# EasyEDA Pro project Soruce.epro, board PCB1
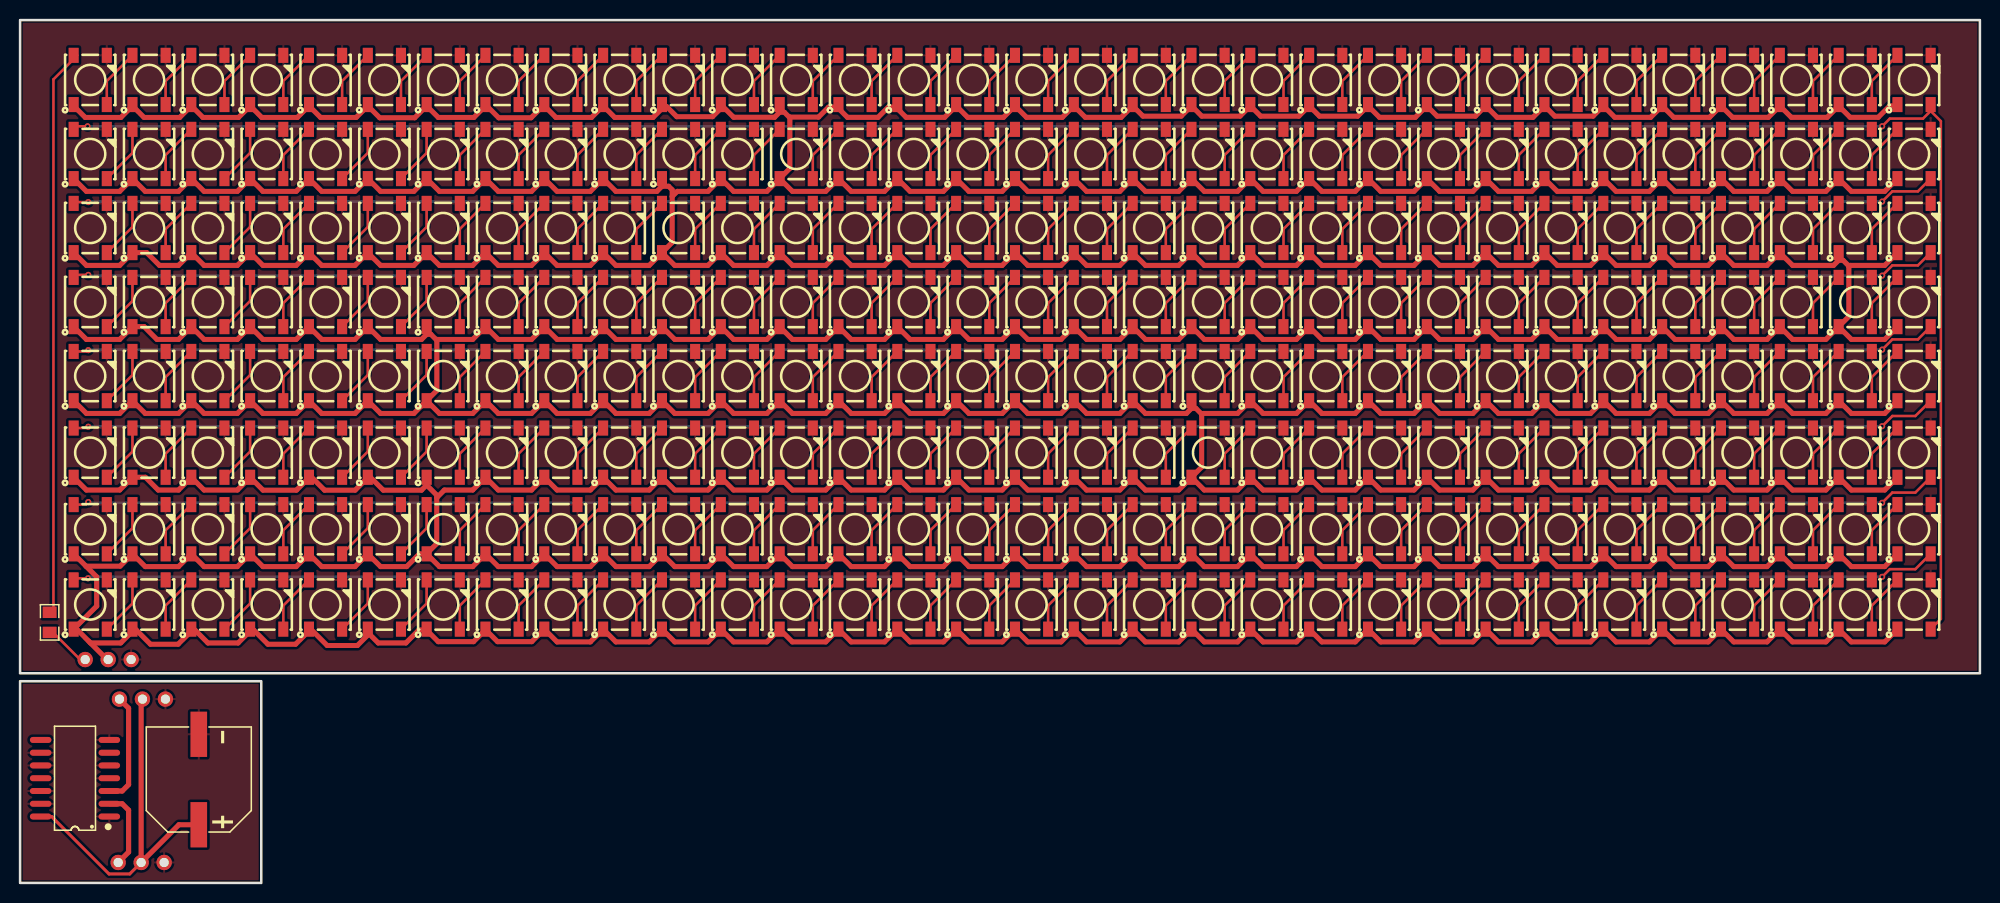
[diagram p3: board, top side]
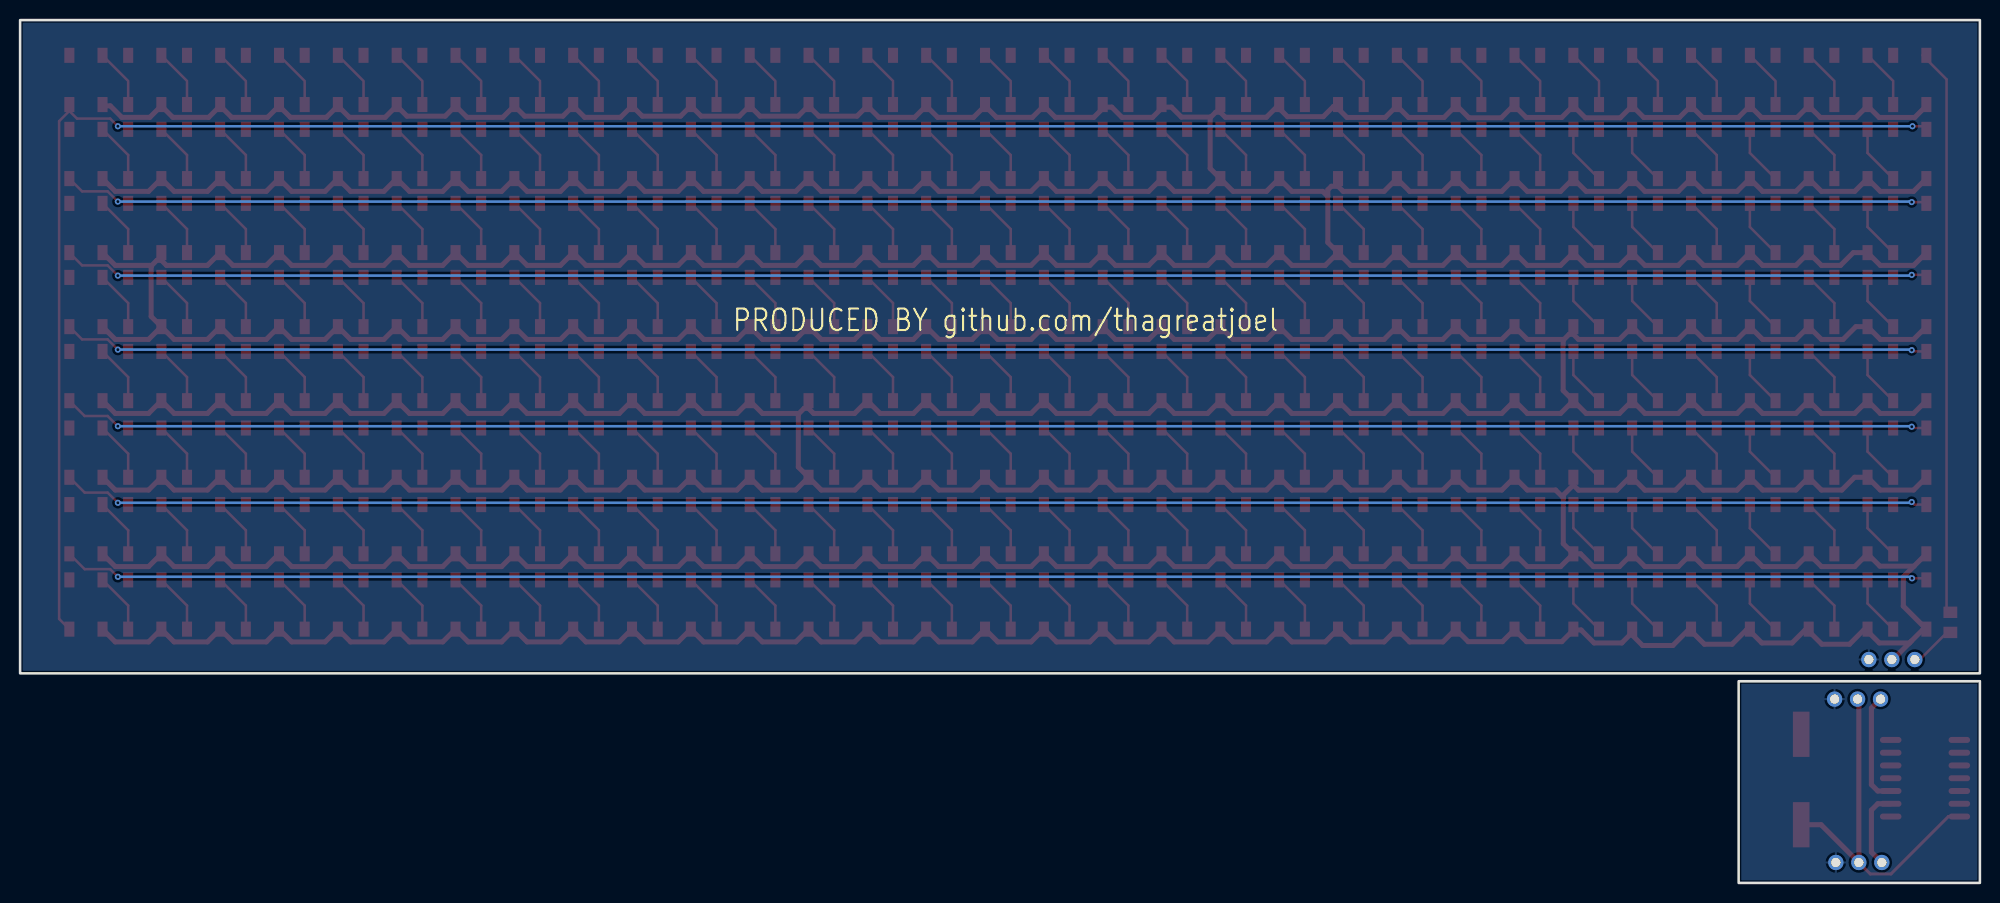
[diagram p4: board, bottom side, seen from below]

Outline 195 x 85.85 mm; copper layers: Top Layer, Bottom Layer. Coordinates in mm from the lower left corner of the outline.
Outline path: rectangle 0,85.85 195,20.85 ; rectangle 0,20.07 24,0
Stack: Top Layer 0.035mm / Dielectric1 1.51mm FR4 er 4.5 / Bottom Layer 0.035mm

## Design rules (mm)
template: JLCPCB Capability(Two Layers Board)
spacing copperThickness1oz (default): track to track 0.102, other pairs 0.152 to 0.3
spacing copperThickness2oz: track to track 0.203, other pairs 0.152 to 0.3
track width copperThickness1oz (default): min 0.127, default 0.254, max 2.54
track width copperThickness2oz: min 0.203, default 0.254, max 2.54
differential pair differentialPair (default): width min 0.127, default 0.254, max 2.54; gap min 0.152, default 0.152
via viaSize (default): diameter min 0.5, default 0.61, max 10; hole min 0.3, default 0.305, max 6.3

## Placement (name value [footprint] x y rotation side)
C1  1000uF  [CAP-SMD_BD10.0-L10.3-W10.3-LS11.3-FD]  17.78 10.29 90 top
LED0  WS2812B-B/T  [LED-SMD_4P-L5.0-W5.0-TL_WS2812B-B]  6.98 79.9 90 top
LED1  WS2812B-B/T  [LED-SMD_4P-L5.0-W5.0-TL_WS2812B-B]  12.83 79.9 90 top
LED2  WS2812B-B/T  [LED-SMD_4P-L5.0-W5.0-TL_WS2812B-B]  18.68 79.9 90 top
LED3  WS2812B-B/T  [LED-SMD_4P-L5.0-W5.0-TL_WS2812B-B]  24.54 79.9 90 top
LED4  WS2812B-B/T  [LED-SMD_4P-L5.0-W5.0-TL_WS2812B-B]  30.39 79.9 90 top
LED5  WS2812B-B/T  [LED-SMD_4P-L5.0-W5.0-TL_WS2812B-B]  36.25 79.9 90 top
LED6  WS2812B-B/T  [LED-SMD_4P-L5.0-W5.0-TL_WS2812B-B]  42.1 79.9 90 top
LED7  WS2812B-B/T  [LED-SMD_4P-L5.0-W5.0-TL_WS2812B-B]  47.95 79.9 90 top
LED8  WS2812B-B/T  [LED-SMD_4P-L5.0-W5.0-TL_WS2812B-B]  53.81 79.9 90 top
LED9  WS2812B-B/T  [LED-SMD_4P-L5.0-W5.0-TL_WS2812B-B]  59.66 79.9 90 top
LED10  WS2812B-B/T  [LED-SMD_4P-L5.0-W5.0-TL_WS2812B-B]  65.52 79.9 90 top
LED11  WS2812B-B/T  [LED-SMD_4P-L5.0-W5.0-TL_WS2812B-B]  71.37 79.9 90 top
LED12  WS2812B-B/T  [LED-SMD_4P-L5.0-W5.0-TL_WS2812B-B]  77.22 79.9 90 top
LED13  WS2812B-B/T  [LED-SMD_4P-L5.0-W5.0-TL_WS2812B-B]  83.08 79.9 90 top
LED14  WS2812B-B/T  [LED-SMD_4P-L5.0-W5.0-TL_WS2812B-B]  88.93 79.9 90 top
LED15  WS2812B-B/T  [LED-SMD_4P-L5.0-W5.0-TL_WS2812B-B]  94.79 79.9 90 top
LED16  WS2812B-B/T  [LED-SMD_4P-L5.0-W5.0-TL_WS2812B-B]  100.64 79.9 90 top
LED17  WS2812B-B/T  [LED-SMD_4P-L5.0-W5.0-TL_WS2812B-B]  106.49 79.9 90 top
LED18  WS2812B-B/T  [LED-SMD_4P-L5.0-W5.0-TL_WS2812B-B]  112.35 79.9 90 top
LED19  WS2812B-B/T  [LED-SMD_4P-L5.0-W5.0-TL_WS2812B-B]  118.2 79.9 90 top
LED20  WS2812B-B/T  [LED-SMD_4P-L5.0-W5.0-TL_WS2812B-B]  124.06 79.9 90 top
LED21  WS2812B-B/T  [LED-SMD_4P-L5.0-W5.0-TL_WS2812B-B]  129.91 79.9 90 top
LED22  WS2812B-B/T  [LED-SMD_4P-L5.0-W5.0-TL_WS2812B-B]  135.76 79.9 90 top
LED23  WS2812B-B/T  [LED-SMD_4P-L5.0-W5.0-TL_WS2812B-B]  141.62 79.9 90 top
LED24  WS2812B-B/T  [LED-SMD_4P-L5.0-W5.0-TL_WS2812B-B]  147.47 79.9 90 top
LED25  WS2812B-B/T  [LED-SMD_4P-L5.0-W5.0-TL_WS2812B-B]  153.33 79.9 90 top
LED26  WS2812B-B/T  [LED-SMD_4P-L5.0-W5.0-TL_WS2812B-B]  159.18 79.9 90 top
LED27  WS2812B-B/T  [LED-SMD_4P-L5.0-W5.0-TL_WS2812B-B]  165.03 79.9 90 top
LED28  WS2812B-B/T  [LED-SMD_4P-L5.0-W5.0-TL_WS2812B-B]  170.89 79.9 90 top
LED29  WS2812B-B/T  [LED-SMD_4P-L5.0-W5.0-TL_WS2812B-B]  176.74 79.9 90 top
LED30  WS2812B-B/T  [LED-SMD_4P-L5.0-W5.0-TL_WS2812B-B]  182.6 79.9 90 top
LED31  WS2812B-B/T  [LED-SMD_4P-L5.0-W5.0-TL_WS2812B-B]  188.45 79.9 90 top
LED32  WS2812B-B/T  [LED-SMD_4P-L5.0-W5.0-TL_WS2812B-B]  42.1 72.53 90 top
LED33  WS2812B-B/T  [LED-SMD_4P-L5.0-W5.0-TL_WS2812B-B]  24.54 72.53 90 top
LED34  WS2812B-B/T  [LED-SMD_4P-L5.0-W5.0-TL_WS2812B-B]  47.95 72.53 90 top
LED35  WS2812B-B/T  [LED-SMD_4P-L5.0-W5.0-TL_WS2812B-B]  53.81 72.53 90 top
LED36  WS2812B-B/T  [LED-SMD_4P-L5.0-W5.0-TL_WS2812B-B]  36.25 72.53 90 top
LED37  WS2812B-B/T  [LED-SMD_4P-L5.0-W5.0-TL_WS2812B-B]  12.83 72.53 90 top
LED38  WS2812B-B/T  [LED-SMD_4P-L5.0-W5.0-TL_WS2812B-B]  30.39 72.53 90 top
LED39  WS2812B-B/T  [LED-SMD_4P-L5.0-W5.0-TL_WS2812B-B]  18.68 72.53 90 top
LED40  WS2812B-B/T  [LED-SMD_4P-L5.0-W5.0-TL_WS2812B-B]  6.98 72.53 90 top
LED41  WS2812B-B/T  [LED-SMD_4P-L5.0-W5.0-TL_WS2812B-B]  59.66 72.53 90 top
LED42  WS2812B-B/T  [LED-SMD_4P-L5.0-W5.0-TL_WS2812B-B]  65.52 72.53 90 top
LED43  WS2812B-B/T  [LED-SMD_4P-L5.0-W5.0-TL_WS2812B-B]  71.37 72.53 90 top
LED44  WS2812B-B/T  [LED-SMD_4P-L5.0-W5.0-TL_WS2812B-B]  77.22 72.53 90 top
LED45  WS2812B-B/T  [LED-SMD_4P-L5.0-W5.0-TL_WS2812B-B]  83.08 72.53 90 top
LED46  WS2812B-B/T  [LED-SMD_4P-L5.0-W5.0-TL_WS2812B-B]  88.93 72.53 90 top
LED47  WS2812B-B/T  [LED-SMD_4P-L5.0-W5.0-TL_WS2812B-B]  94.79 72.53 90 top
LED48  WS2812B-B/T  [LED-SMD_4P-L5.0-W5.0-TL_WS2812B-B]  100.64 72.53 90 top
LED49  WS2812B-B/T  [LED-SMD_4P-L5.0-W5.0-TL_WS2812B-B]  106.49 72.53 90 top
LED50  WS2812B-B/T  [LED-SMD_4P-L5.0-W5.0-TL_WS2812B-B]  112.35 72.53 90 top
LED51  WS2812B-B/T  [LED-SMD_4P-L5.0-W5.0-TL_WS2812B-B]  118.2 72.53 90 top
LED52  WS2812B-B/T  [LED-SMD_4P-L5.0-W5.0-TL_WS2812B-B]  124.06 72.53 90 top
LED53  WS2812B-B/T  [LED-SMD_4P-L5.0-W5.0-TL_WS2812B-B]  129.91 72.53 90 top
LED54  WS2812B-B/T  [LED-SMD_4P-L5.0-W5.0-TL_WS2812B-B]  135.76 72.53 90 top
LED55  WS2812B-B/T  [LED-SMD_4P-L5.0-W5.0-TL_WS2812B-B]  141.62 72.53 90 top
LED56  WS2812B-B/T  [LED-SMD_4P-L5.0-W5.0-TL_WS2812B-B]  147.47 72.53 90 top
LED57  WS2812B-B/T  [LED-SMD_4P-L5.0-W5.0-TL_WS2812B-B]  153.33 72.53 90 top
LED58  WS2812B-B/T  [LED-SMD_4P-L5.0-W5.0-TL_WS2812B-B]  159.18 72.53 90 top
LED59  WS2812B-B/T  [LED-SMD_4P-L5.0-W5.0-TL_WS2812B-B]  165.03 72.53 90 top
LED60  WS2812B-B/T  [LED-SMD_4P-L5.0-W5.0-TL_WS2812B-B]  170.89 72.53 90 top
LED61  WS2812B-B/T  [LED-SMD_4P-L5.0-W5.0-TL_WS2812B-B]  176.74 72.53 90 top
LED62  WS2812B-B/T  [LED-SMD_4P-L5.0-W5.0-TL_WS2812B-B]  182.6 72.53 90 top
LED63  WS2812B-B/T  [LED-SMD_4P-L5.0-W5.0-TL_WS2812B-B]  188.45 72.53 90 top
LED64  WS2812B-B/T  [LED-SMD_4P-L5.0-W5.0-TL_WS2812B-B]  42.1 65.16 90 top
LED65  WS2812B-B/T  [LED-SMD_4P-L5.0-W5.0-TL_WS2812B-B]  24.54 65.16 90 top
LED66  WS2812B-B/T  [LED-SMD_4P-L5.0-W5.0-TL_WS2812B-B]  47.95 65.16 90 top
LED67  WS2812B-B/T  [LED-SMD_4P-L5.0-W5.0-TL_WS2812B-B]  53.81 65.16 90 top
LED68  WS2812B-B/T  [LED-SMD_4P-L5.0-W5.0-TL_WS2812B-B]  36.25 65.16 90 top
LED69  WS2812B-B/T  [LED-SMD_4P-L5.0-W5.0-TL_WS2812B-B]  12.83 65.16 90 top
LED70  WS2812B-B/T  [LED-SMD_4P-L5.0-W5.0-TL_WS2812B-B]  30.39 65.16 90 top
LED71  WS2812B-B/T  [LED-SMD_4P-L5.0-W5.0-TL_WS2812B-B]  18.68 65.16 90 top
LED72  WS2812B-B/T  [LED-SMD_4P-L5.0-W5.0-TL_WS2812B-B]  6.98 65.16 90 top
LED73  WS2812B-B/T  [LED-SMD_4P-L5.0-W5.0-TL_WS2812B-B]  59.66 65.16 90 top
LED74  WS2812B-B/T  [LED-SMD_4P-L5.0-W5.0-TL_WS2812B-B]  65.52 65.16 90 top
LED75  WS2812B-B/T  [LED-SMD_4P-L5.0-W5.0-TL_WS2812B-B]  71.37 65.16 90 top
LED76  WS2812B-B/T  [LED-SMD_4P-L5.0-W5.0-TL_WS2812B-B]  77.22 65.16 90 top
LED77  WS2812B-B/T  [LED-SMD_4P-L5.0-W5.0-TL_WS2812B-B]  83.08 65.16 90 top
LED78  WS2812B-B/T  [LED-SMD_4P-L5.0-W5.0-TL_WS2812B-B]  88.93 65.16 90 top
LED79  WS2812B-B/T  [LED-SMD_4P-L5.0-W5.0-TL_WS2812B-B]  94.79 65.16 90 top
LED80  WS2812B-B/T  [LED-SMD_4P-L5.0-W5.0-TL_WS2812B-B]  100.64 65.16 90 top
LED81  WS2812B-B/T  [LED-SMD_4P-L5.0-W5.0-TL_WS2812B-B]  106.49 65.16 90 top
LED82  WS2812B-B/T  [LED-SMD_4P-L5.0-W5.0-TL_WS2812B-B]  112.35 65.16 90 top
LED83  WS2812B-B/T  [LED-SMD_4P-L5.0-W5.0-TL_WS2812B-B]  118.2 65.16 90 top
LED84  WS2812B-B/T  [LED-SMD_4P-L5.0-W5.0-TL_WS2812B-B]  124.06 65.16 90 top
LED85  WS2812B-B/T  [LED-SMD_4P-L5.0-W5.0-TL_WS2812B-B]  129.91 65.16 90 top
LED86  WS2812B-B/T  [LED-SMD_4P-L5.0-W5.0-TL_WS2812B-B]  135.76 65.16 90 top
LED87  WS2812B-B/T  [LED-SMD_4P-L5.0-W5.0-TL_WS2812B-B]  141.62 65.16 90 top
LED88  WS2812B-B/T  [LED-SMD_4P-L5.0-W5.0-TL_WS2812B-B]  147.47 65.16 90 top
LED89  WS2812B-B/T  [LED-SMD_4P-L5.0-W5.0-TL_WS2812B-B]  153.33 65.16 90 top
LED90  WS2812B-B/T  [LED-SMD_4P-L5.0-W5.0-TL_WS2812B-B]  159.18 65.16 90 top
LED91  WS2812B-B/T  [LED-SMD_4P-L5.0-W5.0-TL_WS2812B-B]  165.03 65.16 90 top
LED92  WS2812B-B/T  [LED-SMD_4P-L5.0-W5.0-TL_WS2812B-B]  170.89 65.16 90 top
LED93  WS2812B-B/T  [LED-SMD_4P-L5.0-W5.0-TL_WS2812B-B]  176.74 65.16 90 top
LED94  WS2812B-B/T  [LED-SMD_4P-L5.0-W5.0-TL_WS2812B-B]  182.6 65.16 90 top
LED95  WS2812B-B/T  [LED-SMD_4P-L5.0-W5.0-TL_WS2812B-B]  188.45 65.16 90 top
LED96  WS2812B-B/T  [LED-SMD_4P-L5.0-W5.0-TL_WS2812B-B]  42.1 57.8 90 top
LED97  WS2812B-B/T  [LED-SMD_4P-L5.0-W5.0-TL_WS2812B-B]  24.54 57.8 90 top
LED98  WS2812B-B/T  [LED-SMD_4P-L5.0-W5.0-TL_WS2812B-B]  47.95 57.8 90 top
LED99  WS2812B-B/T  [LED-SMD_4P-L5.0-W5.0-TL_WS2812B-B]  53.81 57.8 90 top
LED100  WS2812B-B/T  [LED-SMD_4P-L5.0-W5.0-TL_WS2812B-B]  36.25 57.8 90 top
LED101  WS2812B-B/T  [LED-SMD_4P-L5.0-W5.0-TL_WS2812B-B]  12.83 57.8 90 top
LED102  WS2812B-B/T  [LED-SMD_4P-L5.0-W5.0-TL_WS2812B-B]  30.39 57.8 90 top
LED103  WS2812B-B/T  [LED-SMD_4P-L5.0-W5.0-TL_WS2812B-B]  18.68 57.8 90 top
LED104  WS2812B-B/T  [LED-SMD_4P-L5.0-W5.0-TL_WS2812B-B]  6.98 57.8 90 top
LED105  WS2812B-B/T  [LED-SMD_4P-L5.0-W5.0-TL_WS2812B-B]  59.66 57.8 90 top
LED106  WS2812B-B/T  [LED-SMD_4P-L5.0-W5.0-TL_WS2812B-B]  65.52 57.8 90 top
LED107  WS2812B-B/T  [LED-SMD_4P-L5.0-W5.0-TL_WS2812B-B]  71.37 57.8 90 top
LED108  WS2812B-B/T  [LED-SMD_4P-L5.0-W5.0-TL_WS2812B-B]  77.22 57.8 90 top
LED109  WS2812B-B/T  [LED-SMD_4P-L5.0-W5.0-TL_WS2812B-B]  83.08 57.8 90 top
LED110  WS2812B-B/T  [LED-SMD_4P-L5.0-W5.0-TL_WS2812B-B]  88.93 57.8 90 top
LED111  WS2812B-B/T  [LED-SMD_4P-L5.0-W5.0-TL_WS2812B-B]  94.79 57.8 90 top
LED112  WS2812B-B/T  [LED-SMD_4P-L5.0-W5.0-TL_WS2812B-B]  100.64 57.8 90 top
LED113  WS2812B-B/T  [LED-SMD_4P-L5.0-W5.0-TL_WS2812B-B]  106.49 57.8 90 top
LED114  WS2812B-B/T  [LED-SMD_4P-L5.0-W5.0-TL_WS2812B-B]  112.35 57.8 90 top
LED115  WS2812B-B/T  [LED-SMD_4P-L5.0-W5.0-TL_WS2812B-B]  118.2 57.8 90 top
LED116  WS2812B-B/T  [LED-SMD_4P-L5.0-W5.0-TL_WS2812B-B]  124.06 57.8 90 top
LED117  WS2812B-B/T  [LED-SMD_4P-L5.0-W5.0-TL_WS2812B-B]  129.91 57.8 90 top
LED118  WS2812B-B/T  [LED-SMD_4P-L5.0-W5.0-TL_WS2812B-B]  135.76 57.8 90 top
LED119  WS2812B-B/T  [LED-SMD_4P-L5.0-W5.0-TL_WS2812B-B]  141.62 57.8 90 top
LED120  WS2812B-B/T  [LED-SMD_4P-L5.0-W5.0-TL_WS2812B-B]  147.47 57.8 90 top
LED121  WS2812B-B/T  [LED-SMD_4P-L5.0-W5.0-TL_WS2812B-B]  153.33 57.8 90 top
LED122  WS2812B-B/T  [LED-SMD_4P-L5.0-W5.0-TL_WS2812B-B]  159.18 57.8 90 top
LED123  WS2812B-B/T  [LED-SMD_4P-L5.0-W5.0-TL_WS2812B-B]  165.03 57.8 90 top
LED124  WS2812B-B/T  [LED-SMD_4P-L5.0-W5.0-TL_WS2812B-B]  170.89 57.8 90 top
LED125  WS2812B-B/T  [LED-SMD_4P-L5.0-W5.0-TL_WS2812B-B]  176.74 57.8 90 top
LED126  WS2812B-B/T  [LED-SMD_4P-L5.0-W5.0-TL_WS2812B-B]  182.6 57.8 90 top
LED127  WS2812B-B/T  [LED-SMD_4P-L5.0-W5.0-TL_WS2812B-B]  188.45 57.8 90 top
LED128  WS2812B-B/T  [LED-SMD_4P-L5.0-W5.0-TL_WS2812B-B]  42.1 50.43 90 top
LED129  WS2812B-B/T  [LED-SMD_4P-L5.0-W5.0-TL_WS2812B-B]  24.54 50.43 90 top
LED130  WS2812B-B/T  [LED-SMD_4P-L5.0-W5.0-TL_WS2812B-B]  47.95 50.43 90 top
LED131  WS2812B-B/T  [LED-SMD_4P-L5.0-W5.0-TL_WS2812B-B]  53.81 50.43 90 top
LED132  WS2812B-B/T  [LED-SMD_4P-L5.0-W5.0-TL_WS2812B-B]  36.25 50.43 90 top
LED133  WS2812B-B/T  [LED-SMD_4P-L5.0-W5.0-TL_WS2812B-B]  12.83 50.43 90 top
LED134  WS2812B-B/T  [LED-SMD_4P-L5.0-W5.0-TL_WS2812B-B]  30.39 50.43 90 top
LED135  WS2812B-B/T  [LED-SMD_4P-L5.0-W5.0-TL_WS2812B-B]  18.68 50.43 90 top
LED136  WS2812B-B/T  [LED-SMD_4P-L5.0-W5.0-TL_WS2812B-B]  6.98 50.43 90 top
LED137  WS2812B-B/T  [LED-SMD_4P-L5.0-W5.0-TL_WS2812B-B]  59.66 50.43 90 top
LED138  WS2812B-B/T  [LED-SMD_4P-L5.0-W5.0-TL_WS2812B-B]  65.52 50.43 90 top
LED139  WS2812B-B/T  [LED-SMD_4P-L5.0-W5.0-TL_WS2812B-B]  71.37 50.43 90 top
LED140  WS2812B-B/T  [LED-SMD_4P-L5.0-W5.0-TL_WS2812B-B]  77.22 50.43 90 top
LED141  WS2812B-B/T  [LED-SMD_4P-L5.0-W5.0-TL_WS2812B-B]  83.08 50.43 90 top
LED142  WS2812B-B/T  [LED-SMD_4P-L5.0-W5.0-TL_WS2812B-B]  88.93 50.43 90 top
LED143  WS2812B-B/T  [LED-SMD_4P-L5.0-W5.0-TL_WS2812B-B]  94.79 50.43 90 top
LED144  WS2812B-B/T  [LED-SMD_4P-L5.0-W5.0-TL_WS2812B-B]  100.64 50.43 90 top
LED145  WS2812B-B/T  [LED-SMD_4P-L5.0-W5.0-TL_WS2812B-B]  106.49 50.43 90 top
LED146  WS2812B-B/T  [LED-SMD_4P-L5.0-W5.0-TL_WS2812B-B]  112.35 50.43 90 top
LED147  WS2812B-B/T  [LED-SMD_4P-L5.0-W5.0-TL_WS2812B-B]  118.2 50.43 90 top
LED148  WS2812B-B/T  [LED-SMD_4P-L5.0-W5.0-TL_WS2812B-B]  124.06 50.43 90 top
LED149  WS2812B-B/T  [LED-SMD_4P-L5.0-W5.0-TL_WS2812B-B]  129.91 50.43 90 top
LED150  WS2812B-B/T  [LED-SMD_4P-L5.0-W5.0-TL_WS2812B-B]  135.76 50.43 90 top
LED151  WS2812B-B/T  [LED-SMD_4P-L5.0-W5.0-TL_WS2812B-B]  141.62 50.43 90 top
LED152  WS2812B-B/T  [LED-SMD_4P-L5.0-W5.0-TL_WS2812B-B]  147.47 50.43 90 top
LED153  WS2812B-B/T  [LED-SMD_4P-L5.0-W5.0-TL_WS2812B-B]  153.33 50.43 90 top
LED154  WS2812B-B/T  [LED-SMD_4P-L5.0-W5.0-TL_WS2812B-B]  159.18 50.43 90 top
LED155  WS2812B-B/T  [LED-SMD_4P-L5.0-W5.0-TL_WS2812B-B]  165.03 50.43 90 top
LED156  WS2812B-B/T  [LED-SMD_4P-L5.0-W5.0-TL_WS2812B-B]  170.89 50.43 90 top
LED157  WS2812B-B/T  [LED-SMD_4P-L5.0-W5.0-TL_WS2812B-B]  176.74 50.43 90 top
LED158  WS2812B-B/T  [LED-SMD_4P-L5.0-W5.0-TL_WS2812B-B]  182.6 50.43 90 top
LED159  WS2812B-B/T  [LED-SMD_4P-L5.0-W5.0-TL_WS2812B-B]  188.45 50.43 90 top
LED160  WS2812B-B/T  [LED-SMD_4P-L5.0-W5.0-TL_WS2812B-B]  42.1 42.81 90 top
LED161  WS2812B-B/T  [LED-SMD_4P-L5.0-W5.0-TL_WS2812B-B]  24.54 42.81 90 top
LED162  WS2812B-B/T  [LED-SMD_4P-L5.0-W5.0-TL_WS2812B-B]  47.95 42.81 90 top
LED163  WS2812B-B/T  [LED-SMD_4P-L5.0-W5.0-TL_WS2812B-B]  53.81 42.81 90 top
LED164  WS2812B-B/T  [LED-SMD_4P-L5.0-W5.0-TL_WS2812B-B]  36.25 42.81 90 top
LED165  WS2812B-B/T  [LED-SMD_4P-L5.0-W5.0-TL_WS2812B-B]  12.83 42.81 90 top
LED166  WS2812B-B/T  [LED-SMD_4P-L5.0-W5.0-TL_WS2812B-B]  30.39 42.81 90 top
LED167  WS2812B-B/T  [LED-SMD_4P-L5.0-W5.0-TL_WS2812B-B]  18.68 42.81 90 top
LED168  WS2812B-B/T  [LED-SMD_4P-L5.0-W5.0-TL_WS2812B-B]  6.98 42.81 90 top
LED169  WS2812B-B/T  [LED-SMD_4P-L5.0-W5.0-TL_WS2812B-B]  59.66 42.81 90 top
LED170  WS2812B-B/T  [LED-SMD_4P-L5.0-W5.0-TL_WS2812B-B]  65.52 42.81 90 top
LED171  WS2812B-B/T  [LED-SMD_4P-L5.0-W5.0-TL_WS2812B-B]  71.37 42.81 90 top
LED172  WS2812B-B/T  [LED-SMD_4P-L5.0-W5.0-TL_WS2812B-B]  77.22 42.81 90 top
LED173  WS2812B-B/T  [LED-SMD_4P-L5.0-W5.0-TL_WS2812B-B]  83.08 42.81 90 top
LED174  WS2812B-B/T  [LED-SMD_4P-L5.0-W5.0-TL_WS2812B-B]  88.93 42.81 90 top
LED175  WS2812B-B/T  [LED-SMD_4P-L5.0-W5.0-TL_WS2812B-B]  94.79 42.81 90 top
LED176  WS2812B-B/T  [LED-SMD_4P-L5.0-W5.0-TL_WS2812B-B]  100.64 42.81 90 top
LED177  WS2812B-B/T  [LED-SMD_4P-L5.0-W5.0-TL_WS2812B-B]  106.49 42.81 90 top
LED178  WS2812B-B/T  [LED-SMD_4P-L5.0-W5.0-TL_WS2812B-B]  112.35 42.81 90 top
LED179  WS2812B-B/T  [LED-SMD_4P-L5.0-W5.0-TL_WS2812B-B]  118.2 42.81 90 top
LED180  WS2812B-B/T  [LED-SMD_4P-L5.0-W5.0-TL_WS2812B-B]  124.06 42.81 90 top
LED181  WS2812B-B/T  [LED-SMD_4P-L5.0-W5.0-TL_WS2812B-B]  129.91 42.81 90 top
LED182  WS2812B-B/T  [LED-SMD_4P-L5.0-W5.0-TL_WS2812B-B]  135.76 42.81 90 top
LED183  WS2812B-B/T  [LED-SMD_4P-L5.0-W5.0-TL_WS2812B-B]  141.62 42.81 90 top
LED184  WS2812B-B/T  [LED-SMD_4P-L5.0-W5.0-TL_WS2812B-B]  147.47 42.81 90 top
LED185  WS2812B-B/T  [LED-SMD_4P-L5.0-W5.0-TL_WS2812B-B]  153.33 42.81 90 top
LED186  WS2812B-B/T  [LED-SMD_4P-L5.0-W5.0-TL_WS2812B-B]  159.18 42.81 90 top
LED187  WS2812B-B/T  [LED-SMD_4P-L5.0-W5.0-TL_WS2812B-B]  165.03 42.81 90 top
LED188  WS2812B-B/T  [LED-SMD_4P-L5.0-W5.0-TL_WS2812B-B]  170.89 42.81 90 top
LED189  WS2812B-B/T  [LED-SMD_4P-L5.0-W5.0-TL_WS2812B-B]  176.74 42.81 90 top
LED190  WS2812B-B/T  [LED-SMD_4P-L5.0-W5.0-TL_WS2812B-B]  182.6 42.81 90 top
LED191  WS2812B-B/T  [LED-SMD_4P-L5.0-W5.0-TL_WS2812B-B]  188.45 42.81 90 top
LED192  WS2812B-B/T  [LED-SMD_4P-L5.0-W5.0-TL_WS2812B-B]  42.1 35.19 90 top
LED193  WS2812B-B/T  [LED-SMD_4P-L5.0-W5.0-TL_WS2812B-B]  24.54 35.19 90 top
LED194  WS2812B-B/T  [LED-SMD_4P-L5.0-W5.0-TL_WS2812B-B]  47.95 35.19 90 top
LED195  WS2812B-B/T  [LED-SMD_4P-L5.0-W5.0-TL_WS2812B-B]  53.81 35.19 90 top
LED196  WS2812B-B/T  [LED-SMD_4P-L5.0-W5.0-TL_WS2812B-B]  36.25 35.19 90 top
LED197  WS2812B-B/T  [LED-SMD_4P-L5.0-W5.0-TL_WS2812B-B]  12.83 35.19 90 top
LED198  WS2812B-B/T  [LED-SMD_4P-L5.0-W5.0-TL_WS2812B-B]  30.39 35.19 90 top
LED199  WS2812B-B/T  [LED-SMD_4P-L5.0-W5.0-TL_WS2812B-B]  18.68 35.19 90 top
LED200  WS2812B-B/T  [LED-SMD_4P-L5.0-W5.0-TL_WS2812B-B]  6.98 35.19 90 top
LED201  WS2812B-B/T  [LED-SMD_4P-L5.0-W5.0-TL_WS2812B-B]  59.66 35.19 90 top
LED202  WS2812B-B/T  [LED-SMD_4P-L5.0-W5.0-TL_WS2812B-B]  65.52 35.19 90 top
LED203  WS2812B-B/T  [LED-SMD_4P-L5.0-W5.0-TL_WS2812B-B]  71.37 35.19 90 top
LED204  WS2812B-B/T  [LED-SMD_4P-L5.0-W5.0-TL_WS2812B-B]  77.22 35.19 90 top
LED205  WS2812B-B/T  [LED-SMD_4P-L5.0-W5.0-TL_WS2812B-B]  83.08 35.19 90 top
LED206  WS2812B-B/T  [LED-SMD_4P-L5.0-W5.0-TL_WS2812B-B]  88.93 35.19 90 top
LED207  WS2812B-B/T  [LED-SMD_4P-L5.0-W5.0-TL_WS2812B-B]  94.79 35.19 90 top
LED208  WS2812B-B/T  [LED-SMD_4P-L5.0-W5.0-TL_WS2812B-B]  100.64 35.19 90 top
LED209  WS2812B-B/T  [LED-SMD_4P-L5.0-W5.0-TL_WS2812B-B]  106.49 35.19 90 top
LED210  WS2812B-B/T  [LED-SMD_4P-L5.0-W5.0-TL_WS2812B-B]  112.35 35.19 90 top
LED211  WS2812B-B/T  [LED-SMD_4P-L5.0-W5.0-TL_WS2812B-B]  118.2 35.19 90 top
LED212  WS2812B-B/T  [LED-SMD_4P-L5.0-W5.0-TL_WS2812B-B]  124.06 35.19 90 top
LED213  WS2812B-B/T  [LED-SMD_4P-L5.0-W5.0-TL_WS2812B-B]  129.91 35.19 90 top
LED214  WS2812B-B/T  [LED-SMD_4P-L5.0-W5.0-TL_WS2812B-B]  135.76 35.19 90 top
LED215  WS2812B-B/T  [LED-SMD_4P-L5.0-W5.0-TL_WS2812B-B]  141.62 35.19 90 top
LED216  WS2812B-B/T  [LED-SMD_4P-L5.0-W5.0-TL_WS2812B-B]  147.47 35.19 90 top
LED217  WS2812B-B/T  [LED-SMD_4P-L5.0-W5.0-TL_WS2812B-B]  153.33 35.19 90 top
LED218  WS2812B-B/T  [LED-SMD_4P-L5.0-W5.0-TL_WS2812B-B]  159.18 35.19 90 top
LED219  WS2812B-B/T  [LED-SMD_4P-L5.0-W5.0-TL_WS2812B-B]  165.03 35.19 90 top
LED220  WS2812B-B/T  [LED-SMD_4P-L5.0-W5.0-TL_WS2812B-B]  170.89 35.19 90 top
LED221  WS2812B-B/T  [LED-SMD_4P-L5.0-W5.0-TL_WS2812B-B]  176.74 35.19 90 top
LED222  WS2812B-B/T  [LED-SMD_4P-L5.0-W5.0-TL_WS2812B-B]  182.6 35.19 90 top
LED223  WS2812B-B/T  [LED-SMD_4P-L5.0-W5.0-TL_WS2812B-B]  188.45 35.19 90 top
LED224  WS2812B-B/T  [LED-SMD_4P-L5.0-W5.0-TL_WS2812B-B]  42.1 27.7 90 top
LED225  WS2812B-B/T  [LED-SMD_4P-L5.0-W5.0-TL_WS2812B-B]  24.54 27.7 90 top
LED226  WS2812B-B/T  [LED-SMD_4P-L5.0-W5.0-TL_WS2812B-B]  47.95 27.7 90 top
LED227  WS2812B-B/T  [LED-SMD_4P-L5.0-W5.0-TL_WS2812B-B]  53.81 27.7 90 top
LED228  WS2812B-B/T  [LED-SMD_4P-L5.0-W5.0-TL_WS2812B-B]  36.25 27.7 90 top
LED229  WS2812B-B/T  [LED-SMD_4P-L5.0-W5.0-TL_WS2812B-B]  12.83 27.7 90 top
LED230  WS2812B-B/T  [LED-SMD_4P-L5.0-W5.0-TL_WS2812B-B]  30.39 27.7 90 top
LED231  WS2812B-B/T  [LED-SMD_4P-L5.0-W5.0-TL_WS2812B-B]  18.68 27.7 90 top
LED232  WS2812B-B/T  [LED-SMD_4P-L5.0-W5.0-TL_WS2812B-B]  6.98 27.7 90 top
LED233  WS2812B-B/T  [LED-SMD_4P-L5.0-W5.0-TL_WS2812B-B]  59.66 27.7 90 top
LED234  WS2812B-B/T  [LED-SMD_4P-L5.0-W5.0-TL_WS2812B-B]  65.52 27.7 90 top
LED235  WS2812B-B/T  [LED-SMD_4P-L5.0-W5.0-TL_WS2812B-B]  71.37 27.7 90 top
LED236  WS2812B-B/T  [LED-SMD_4P-L5.0-W5.0-TL_WS2812B-B]  77.22 27.7 90 top
LED237  WS2812B-B/T  [LED-SMD_4P-L5.0-W5.0-TL_WS2812B-B]  83.08 27.7 90 top
LED238  WS2812B-B/T  [LED-SMD_4P-L5.0-W5.0-TL_WS2812B-B]  88.93 27.7 90 top
LED239  WS2812B-B/T  [LED-SMD_4P-L5.0-W5.0-TL_WS2812B-B]  94.79 27.7 90 top
LED240  WS2812B-B/T  [LED-SMD_4P-L5.0-W5.0-TL_WS2812B-B]  100.64 27.7 90 top
LED241  WS2812B-B/T  [LED-SMD_4P-L5.0-W5.0-TL_WS2812B-B]  106.49 27.7 90 top
LED242  WS2812B-B/T  [LED-SMD_4P-L5.0-W5.0-TL_WS2812B-B]  112.35 27.7 90 top
LED243  WS2812B-B/T  [LED-SMD_4P-L5.0-W5.0-TL_WS2812B-B]  118.2 27.7 90 top
LED244  WS2812B-B/T  [LED-SMD_4P-L5.0-W5.0-TL_WS2812B-B]  124.06 27.7 90 top
LED245  WS2812B-B/T  [LED-SMD_4P-L5.0-W5.0-TL_WS2812B-B]  129.91 27.7 90 top
LED246  WS2812B-B/T  [LED-SMD_4P-L5.0-W5.0-TL_WS2812B-B]  135.76 27.7 90 top
LED247  WS2812B-B/T  [LED-SMD_4P-L5.0-W5.0-TL_WS2812B-B]  141.62 27.7 90 top
LED248  WS2812B-B/T  [LED-SMD_4P-L5.0-W5.0-TL_WS2812B-B]  147.47 27.7 90 top
LED249  WS2812B-B/T  [LED-SMD_4P-L5.0-W5.0-TL_WS2812B-B]  153.33 27.7 90 top
LED250  WS2812B-B/T  [LED-SMD_4P-L5.0-W5.0-TL_WS2812B-B]  159.18 27.7 90 top
LED251  WS2812B-B/T  [LED-SMD_4P-L5.0-W5.0-TL_WS2812B-B]  165.03 27.7 90 top
LED252  WS2812B-B/T  [LED-SMD_4P-L5.0-W5.0-TL_WS2812B-B]  170.89 27.7 90 top
LED253  WS2812B-B/T  [LED-SMD_4P-L5.0-W5.0-TL_WS2812B-B]  176.74 27.7 90 top
LED254  WS2812B-B/T  [LED-SMD_4P-L5.0-W5.0-TL_WS2812B-B]  182.6 27.7 90 top
LED255  WS2812B-B/T  [LED-SMD_4P-L5.0-W5.0-TL_WS2812B-B]  188.45 27.7 90 top
NOREF  -  [Pad_e346]  14.33 2.03 0 top
NOREF#2  -  [Pad_e345]  12.05 2.03 0 top
NOREF#3  -  [Pad_e332]  14.46 18.29 0 top
NOREF#4  -  [Pad_e331]  12.17 18.29 0 top
NOREF#5  -  [Pad_e282]  8.76 22.23 0 top
NOREF#6  -  [Pad_e280]  6.48 22.23 0 top
NOREF#7  -  [Pad_e283]  11.05 22.23 0 top
NOREF#8  -  [Pad_e330]  9.89 18.29 0 top
NOREF#9  -  [Pad_e344]  9.76 2.03 0 top
R2  470Ω  [R0805]  2.94 25.92 90 top
U2  SN74AHCT125NSR  [SOP-14_L10.2-W5.3-P1.27-LS7.8-BL]  5.46 10.41 90 top

## Footprints (pads in the part's own frame, mm; a bottom-side part is the same pattern mirrored in y, then rotated)
CAP-SMD_BD10.0-L10.3-W10.3-LS11.3-FD
  rect 4.5x1.65 smd: 1(-4.5,0) 2(4.5,0)
LED-SMD_4P-L5.0-W5.0-TL_WS2812B-B
  rect 1.5x1 smd: 1(-2.45,1.65) 2(-2.45,-1.65) 3(2.45,-1.65) 4(2.45,1.65)
Pad_e280
  round 1.524 hole 0.914: 1(0,0)
Pad_e282
  round 1.524 hole 0.914: 3(0,0)
Pad_e283
  round 1.524 hole 0.914: 4(0,0)
Pad_e330
  round 1.524 hole 0.914: 1(0,0)
Pad_e331
  round 1.524 hole 0.914: 3(0,0)
Pad_e332
  round 1.524 hole 0.914: 4(0,0)
Pad_e344
  round 1.524 hole 0.914: 1(0,0)
Pad_e345
  round 1.524 hole 0.914: 3(0,0)
Pad_e346
  round 1.524 hole 0.914: 4(0,0)
R0805
  rect 1.133x1.377 smd: 1(-1,0) 2(1,0)
SOP-14_L10.2-W5.3-P1.27-LS7.8-BL
  oval 0.595x2.143 smd: 1(-3.81,-3.415) 2(-2.54,-3.415) 3(-1.27,-3.415) 4(0,-3.415) 5(1.27,-3.415) 6(2.54,-3.415) 7(3.81,-3.415) 8(3.81,3.415) 9(2.54,3.415) 10(1.27,3.415) 11(0,3.415) 12(-1.27,3.415) 13(-2.54,3.415) 14(-3.81,3.415)

## Nets
As in the schematic, except:
+5V: C1.1 LED0.1 LED1.1 LED2.1 LED3.1 LED4.1 LED5.1 LED6.1 LED7.1 LED8.1 LED9.1 LED10.1 LED11.1 LED12.1 LED13.1 LED14.1 LED15.1 LED16.1 LED17.1 LED18.1 LED19.1 LED20.1 LED21.1 LED22.1 LED23.1 LED24.1 LED25.1 LED26.1 LED27.1 LED28.1 LED29.1 LED30.1 LED31.1 LED32.1 LED33.1 LED34.1 LED35.1 LED36.1 LED37.1 LED38.1 LED39.1 LED40.1 LED41.1 LED42.1 LED43.1 LED44.1 LED45.1 LED46.1 LED47.1 LED48.1 LED49.1 LED50.1 LED51.1 LED52.1 LED53.1 LED54.1 LED55.1 LED56.1 LED57.1 LED58.1 LED59.1 LED60.1 LED61.1 LED62.1 LED63.1 LED64.1 LED65.1 LED66.1 LED67.1 LED68.1 LED69.1 LED70.1 LED71.1 LED72.1 LED73.1 LED74.1 LED75.1 LED76.1 LED77.1 LED78.1 LED79.1 LED80.1 LED81.1 LED82.1 LED83.1 LED84.1 LED85.1 LED86.1 LED87.1 LED88.1 LED89.1 LED90.1 LED91.1 LED92.1 LED93.1 LED94.1 LED95.1 LED96.1 LED97.1 LED98.1 LED99.1 LED100.1 LED101.1 LED102.1 LED103.1 LED104.1 LED105.1 LED106.1 LED107.1 LED108.1 LED109.1 LED110.1 LED111.1 LED112.1 LED113.1 LED114.1 LED115.1 LED116.1 LED117.1 LED118.1 LED119.1 LED120.1 LED121.1 LED122.1 LED123.1 LED124.1 LED125.1 LED126.1 LED127.1 LED128.1 LED129.1 LED130.1 LED131.1 LED132.1 LED133.1 LED134.1 LED135.1 LED136.1 LED137.1 LED138.1 LED139.1 LED140.1 LED141.1 LED142.1 LED143.1 LED144.1 LED145.1 LED146.1 LED147.1 LED148.1 LED149.1 LED150.1 LED151.1 LED152.1 LED153.1 LED154.1 LED155.1 LED156.1 LED157.1 LED158.1 LED159.1 LED160.1 LED161.1 LED162.1 LED163.1 LED164.1 LED165.1 LED166.1 LED167.1 LED168.1 LED169.1 LED170.1 LED171.1 LED172.1 LED173.1 LED174.1 LED175.1 LED176.1 LED177.1 LED178.1 LED179.1 LED180.1 LED181.1 LED182.1 LED183.1 LED184.1 LED185.1 LED186.1 LED187.1 LED188.1 LED189.1 LED190.1 LED191.1 LED192.1 LED193.1 LED194.1 LED195.1 LED196.1 LED197.1 LED198.1 LED199.1 LED200.1 LED201.1 LED202.1 LED203.1 LED204.1 LED205.1 LED206.1 LED207.1 LED208.1 LED209.1 LED210.1 LED211.1 LED212.1 LED213.1 LED214.1 LED215.1 LED216.1 LED217.1 LED218.1 LED219.1 LED220.1 LED221.1 LED222.1 LED223.1 LED224.1 LED225.1 LED226.1 LED227.1 LED228.1 LED229.1 LED230.1 LED231.1 LED232.1 LED233.1 LED234.1 LED235.1 LED236.1 LED237.1 LED238.1 LED239.1 LED240.1 LED241.1 LED242.1 LED243.1 LED244.1 LED245.1 LED246.1 LED247.1 LED248.1 LED249.1 LED250.1 LED251.1 LED252.1 LED253.1 LED254.1 LED255.1 NOREF#2.3 NOREF#4.3 NOREF#5.3 U2.14
GND: C1.2 LED0.3 LED1.3 LED2.3 LED3.3 LED4.3 LED5.3 LED6.3 LED7.3 LED8.3 LED9.3 LED10.3 LED11.3 LED12.3 LED13.3 LED14.3 LED15.3 LED16.3 LED17.3 LED18.3 LED19.3 LED20.3 LED21.3 LED22.3 LED23.3 LED24.3 LED25.3 LED26.3 LED27.3 LED28.3 LED29.3 LED30.3 LED31.3 LED32.3 LED33.3 LED34.3 LED35.3 LED36.3 LED37.3 LED38.3 LED39.3 LED40.3 LED41.3 LED42.3 LED43.3 LED44.3 LED45.3 LED46.3 LED47.3 LED48.3 LED49.3 LED50.3 LED51.3 LED52.3 LED53.3 LED54.3 LED55.3 LED56.3 LED57.3 LED58.3 LED59.3 LED60.3 LED61.3 LED62.3 LED63.3 LED64.3 LED65.3 LED66.3 LED67.3 LED68.3 LED69.3 LED70.3 LED71.3 LED72.3 LED73.3 LED74.3 LED75.3 LED76.3 LED77.3 LED78.3 LED79.3 LED80.3 LED81.3 LED82.3 LED83.3 LED84.3 LED85.3 LED86.3 LED87.3 LED88.3 LED89.3 LED90.3 LED91.3 LED92.3 LED93.3 LED94.3 LED95.3 LED96.3 LED97.3 LED98.3 LED99.3 LED100.3 LED101.3 LED102.3 LED103.3 LED104.3 LED105.3 LED106.3 LED107.3 LED108.3 LED109.3 LED110.3 LED111.3 LED112.3 LED113.3 LED114.3 LED115.3 LED116.3 LED117.3 LED118.3 LED119.3 LED120.3 LED121.3 LED122.3 LED123.3 LED124.3 LED125.3 LED126.3 LED127.3 LED128.3 LED129.3 LED130.3 LED131.3 LED132.3 LED133.3 LED134.3 LED135.3 LED136.3 LED137.3 LED138.3 LED139.3 LED140.3 LED141.3 LED142.3 LED143.3 LED144.3 LED145.3 LED146.3 LED147.3 LED148.3 LED149.3 LED150.3 LED151.3 LED152.3 LED153.3 LED154.3 LED155.3 LED156.3 LED157.3 LED158.3 LED159.3 LED160.3 LED161.3 LED162.3 LED163.3 LED164.3 LED165.3 LED166.3 LED167.3 LED168.3 LED169.3 LED170.3 LED171.3 LED172.3 LED173.3 LED174.3 LED175.3 LED176.3 LED177.3 LED178.3 LED179.3 LED180.3 LED181.3 LED182.3 LED183.3 LED184.3 LED185.3 LED186.3 LED187.3 LED188.3 LED189.3 LED190.3 LED191.3 LED192.3 LED193.3 LED194.3 LED195.3 LED196.3 LED197.3 LED198.3 LED199.3 LED200.3 LED201.3 LED202.3 LED203.3 LED204.3 LED205.3 LED206.3 LED207.3 LED208.3 LED209.3 LED210.3 LED211.3 LED212.3 LED213.3 LED214.3 LED215.3 LED216.3 LED217.3 LED218.3 LED219.3 LED220.3 LED221.3 LED222.3 LED223.3 LED224.3 LED225.3 LED226.3 LED227.3 LED228.3 LED229.3 LED230.3 LED231.3 LED232.3 LED233.3 LED234.3 LED235.3 LED236.3 LED237.3 LED238.3 LED239.3 LED240.3 LED241.3 LED242.3 LED243.3 LED244.3 LED245.3 LED246.3 LED247.3 LED248.3 LED249.3 LED250.3 LED251.3 LED252.3 LED253.3 LED254.3 LED255.3 NOREF.4 NOREF#3.4 NOREF#7.4 U2.1 U2.4 U2.5 U2.7 U2.9 U2.10 U2.12 U2.13
GPIO16: NOREF#9.1 U2.2
$3N534: NOREF#6.1 NOREF#8.1 R2.1 U2.3

Pads without a net: U2 6 8 11

## Via types
v1: diameter 0.61, hole 0.305, Top Layer to Bottom Layer, 14 vias

## Routing (per net, layer and track width the routed paths; a pad name or vN(x,y) marks a point on that pad's centre or on a via; arc(x,y) is an arc through that point)
+5V: length 1797.8
  Top Layer w0.305: NOREF#2.3 10.9,0.89 8.85,0.89 3.14,6.6 U2.14
  Top Layer w0.5: LED44.1 74.3,68.81 70.99,68.81 LED43.1 68.45,68.81 65.39,68.81 64.88,68.3 ; LED44.1 76.84,68.81 80.16,68.81 LED45.1 82.7,68.81 86.01,68.81 LED46.1 88.55,68.81 91.87,68.81 LED47.1 94.41,68.81 97.72,68.81 LED48.1 100.26,68.81 103.57,68.81 LED49.1 106.11,68.81 109.43,68.81 LED50.1 111.97,68.81 115.28,68.81 LED51.1 117.82,68.81 121.14,68.81 LED52.1 123.68,68.81 126.99,68.81 LED53.1 129.53,68.81 132.84,68.81 LED54.1 135.38,68.81 138.7,68.81 LED55.1 141.24,68.81 144.55,68.81 LED56.1 147.09,68.81 150.41,68.81 LED57.1 152.95,68.81 156.26,68.81 LED58.1 158.8,68.81 162.11,68.81 LED59.1 164.65,68.81 167.97,68.81 LED60.1 170.51,68.81 173.82,68.81 LED61.1 176.36,68.81 179.68,68.81 LED62.1 182.22,68.81 185.53,68.81 LED63.1 ; LED44.1 76.59,71.1 76.59,76.13 ; LED191.1 185.53,39.09 182.22,39.09 LED190.1 179.68,39.09 176.36,39.09 LED189.1 173.82,39.09 170.51,39.09 LED188.1 167.97,39.09 164.65,39.09 LED187.1 162.11,39.09 158.8,39.09 LED186.1 156.26,39.09 152.95,39.09 LED185.1 150.41,39.09 147.09,39.09 LED184.1 144.55,39.09 141.24,39.09 LED183.1 138.7,39.09 135.38,39.09 LED182.1 132.84,39.09 129.53,39.09 LED181.1 126.99,39.09 123.68,39.09 LED180.1 121.14,39.09 117.82,39.09 LED179.1 ; LED168.1 6.6,39.09 9.91,39.09 LED165.1 12.47,40.36 13.74,39.09 15.76,39.09 LED167.1 18.3,39.09 21.62,39.09 LED161.1 24.17,39.08 27.5,39.08 28.77,40.35 LED166.1 ; 34.6,24.91 35.63,23.88 38.39,23.88 39.68,25.17 40.44,25.17 ; 34.6,24.91 LED228.1 ; 34.6,24.91 34.6,24.66 33.56,23.62 30.55,23.62 29.01,25.17 28.83,25.17 ; 40.44,25.17 41.6,24 45.12,24 46.28,25.17 46.28,25.23 ; 40.44,25.17 40.44,25.24 LED224.1 ; 46.28,25.23 47.5,24 50.91,24 52.16,25.25 53.43,23.98 56.74,23.98 LED233.1 59.28,23.98 62.6,23.98 LED234.1 65.14,23.98 68.45,23.98 LED235.1 70.99,23.98 74.3,23.98 LED236.1 76.84,23.98 80.16,23.98 LED237.1 82.7,23.98 86.01,23.98 LED238.1 88.55,23.98 91.87,23.98 LED239.1 94.41,23.98 97.72,23.98 LED240.1 100.26,23.98 103.57,23.98 LED241.1 106.11,23.98 109.43,23.98 LED242.1 111.97,23.98 115.28,23.98 LED243.1 117.82,23.98 121.14,23.98 LED244.1 123.68,23.98 126.99,23.98 LED245.1 129.53,23.98 132.84,23.98 LED246.1 135.38,23.98 138.7,23.98 LED247.1 141.24,23.98 144.55,23.98 LED248.1 147.09,23.98 150.41,23.98 LED249.1 152.95,23.98 156.26,23.98 LED250.1 158.8,23.98 162.11,23.98 LED251.1 164.65,23.98 167.97,23.98 LED252.1 170.51,23.98 173.82,23.98 LED253.1 176.36,23.98 179.68,23.98 LED254.1 182.22,23.98 185.53,23.98 LED255.1 ; 46.28,25.23 LED226.1 ; 41.47,53.99 40.87,54.59 40.45,54.59 ; 41.47,53.99 41.47,54.04 41.51,54.08 45.03,54.08 LED98.1 47.57,54.08 50.89,54.08 52.16,55.35 53.43,54.08 56.74,54.08 LED105.1 59.28,54.08 62.6,54.08 LED106.1 65.14,54.08 68.45,54.08 LED107.1 70.99,54.08 74.3,54.08 LED108.1 76.84,54.08 80.16,54.08 LED109.1 82.7,54.08 86.01,54.08 LED110.1 88.55,54.08 91.87,54.08 LED111.1 94.41,54.08 97.72,54.08 LED112.1 100.26,54.08 103.57,54.08 LED113.1 106.11,54.08 109.43,54.08 LED114.1 111.97,54.08 115.28,54.08 LED115.1 117.82,54.08 121.14,54.08 LED116.1 123.68,54.08 126.99,54.08 LED117.1 129.53,54.08 132.84,54.08 LED118.1 135.38,54.08 138.7,54.08 LED119.1 141.24,54.08 144.55,54.08 LED120.1 147.09,54.08 150.41,54.08 LED121.1 152.95,54.08 156.26,54.08 LED122.1 158.8,54.08 162.11,54.08 LED123.1 164.65,54.08 167.97,54.08 LED124.1 170.51,54.08 173.82,54.08 LED125.1 176.36,54.08 179.68,54.08 LED126.1 ; 41.47,53.99 41.47,49 LED128.1 ; LED232.1 5.46,25.17 5.71,25.17 6.83,24.05 ; 116.55,47.22 116.04,46.71 111.97,46.71 LED146.1 109.43,46.71 106.11,46.71 LED145.1 103.57,46.71 100.26,46.71 LED144.1 97.72,46.71 94.41,46.71 LED143.1 91.87,46.71 88.55,46.71 LED142.1 86.01,46.71 82.7,46.71 LED141.1 80.16,46.71 76.84,46.71 LED140.1 74.3,46.71 70.99,46.71 LED139.1 68.45,46.71 65.14,46.71 LED138.1 62.6,46.71 59.28,46.71 LED137.1 56.74,46.71 53.43,46.71 52.16,47.98 50.89,46.71 47.57,46.71 LED130.1 45.03,46.71 41.72,46.71 LED128.1 ; 116.55,47.22 LED147.1 ; 116.55,47.22 116.99,47.22 117.57,46.64 117.57,46.58 ; 64.88,68.3 64.88,63.73 LED74.1 ; 64.88,68.3 64.88,68.97 64.53,69.32 63.87,69.32 ; 46.3,77.32 45.15,76.17 41.6,76.17 40.45,77.32 39.26,76.13 35.78,76.13 34.6,77.32 33.44,76.17 29.89,76.17 28.74,77.32 27.59,76.17 24.04,76.17 22.89,77.32 21.74,76.17 18.19,76.17 17.03,77.32 15.88,76.17 12.33,76.17 11.18,77.32 10.03,76.17 6.48,76.17 5.33,77.32 ; 64,77.19 64.07,77.26 64.32,77.26 65.34,76.24 68.89,76.24 69.85,77.19 ; 64,77.19 63.87,77.32 ; 64,77.19 62.98,76.17 59.16,76.17 58.01,77.32 56.86,76.17 53.31,76.17 52.16,77.32 ; 81.3,77.19 80.44,77.19 79.45,76.2 76.59,76.2 76.59,76.13 ; 81.3,77.19 81.43,77.32 ; 81.3,77.19 82.32,76.18 85.37,76.18 86.38,77.19 87.14,77.19 ; 40.45,39.59 41.45,38.58 41.45,38.33 ; 40.45,39.59 LED160.1 ; 40.45,39.59 39.94,39.08 36.13,39.08 34.86,40.35 ; 22.98,25.17 21.69,23.88 18.69,23.88 17.4,25.17 17.14,25.17 17.03,25.06 15.73,23.75 12.97,23.75 11.55,25.17 11.3,25.17 ; 22.98,25.17 LED225.1 ; 22.98,25.17 23.24,25.17 24.66,23.75 27.41,23.75 28.83,25.17 ; LED179.1 117.57,41.38 117.57,46.58 ; LED179.1 115.28,39.09 111.97,39.09 LED178.1 109.43,39.09 106.11,39.09 LED177.1 103.57,39.09 100.26,39.09 LED176.1 97.72,39.09 94.41,39.09 LED175.1 91.87,39.09 88.55,39.09 LED174.1 86.01,39.09 82.7,39.09 LED173.1 80.16,39.09 76.84,39.09 LED172.1 74.3,39.09 70.99,39.09 LED171.1 68.45,39.09 65.14,39.09 LED170.1 62.6,39.09 59.28,39.09 LED169.1 56.74,39.09 53.43,39.09 52.16,40.36 50.89,39.09 47.57,39.09 LED162.1 45.03,39.09 42.22,39.09 41.45,38.33 ; 63.87,69.32 LED42.1 ; 63.87,69.32 63.36,68.81 59.28,68.81 LED41.1 56.74,68.81 53.43,68.81 52.16,70.08 50.89,68.81 47.57,68.81 LED34.1 45.03,68.81 41.72,68.81 LED32.1 39.18,68.81 35.87,68.81 LED36.1 33.33,68.81 30.01,68.81 LED38.1 27.47,68.81 24.16,68.81 LED33.1 21.62,68.81 18.3,68.81 LED39.1 15.76,68.81 12.45,68.81 LED37.1 9.91,68.81 6.6,68.81 LED40.1 ; LED95.1 185.53,61.44 182.09,61.44 181.96,61.31 ; LED164.1 34.61,40.35 33.34,39.08 30.29,39.08 29.02,40.35 ; LED126.1 182.22,54.08 185.53,54.08 LED127.1 ; LED126.1 181.96,56.36 181.96,61.31 ; 117.57,46.58 117.71,46.71 121.14,46.71 LED148.1 123.68,46.71 126.99,46.71 LED149.1 129.53,46.71 132.84,46.71 LED150.1 135.38,46.71 138.7,46.71 LED151.1 141.24,46.71 144.55,46.71 LED152.1 147.09,46.71 150.41,46.71 LED153.1 152.95,46.71 156.26,46.71 LED154.1 158.8,46.71 162.11,46.71 LED155.1 164.65,46.71 167.97,46.71 LED156.1 170.51,46.71 173.82,46.71 LED157.1 176.36,46.71 179.68,46.71 LED158.1 182.22,46.71 185.53,46.71 LED159.1 ; 76.59,76.13 76.04,76.68 75.57,76.68 ; 87.14,77.19 88.16,76.18 91.99,76.18 93.14,77.32 94.28,76.18 97.85,76.18 98.99,77.32 100.13,76.18 103.7,76.18 104.84,77.32 105.99,76.18 109.56,76.18 110.7,77.32 111.72,76.29 115.53,76.29 116.55,77.32 117.58,76.29 121.38,76.29 122.41,77.32 123.43,76.29 127.24,76.29 128.26,77.32 129.28,76.29 133.09,76.29 134.11,77.32 135.26,76.18 138.82,76.18 139.97,77.32 140.99,76.29 144.8,76.29 145.82,77.32 146.96,76.18 150.53,76.18 151.68,77.32 152.7,76.29 156.5,76.29 157.53,77.32 158.67,76.18 162.24,76.18 163.38,77.32 164.53,76.18 168.09,76.18 169.24,77.32 170.38,76.18 173.95,76.18 175.09,77.32 176.23,76.18 179.8,76.18 180.95,77.32 182.09,76.18 184.88,76.18 186.03,77.32 186.8,77.32 ; 87.14,77.19 87.28,77.32 ; LED104.1 6.6,54.08 9.91,54.08 LED101.1 12.34,55.35 13.61,54.08 15.76,54.08 LED103.1 18.3,54.08 21.62,54.08 LED97.1 24.16,54.08 27.47,54.08 LED102.1 30.01,54.08 33.33,54.08 LED100.1 35.87,54.08 39.94,54.08 40.45,54.59 ; LED72.1 6.6,61.44 9.91,61.44 LED69.1 12.6,62.71 13.87,61.44 15.76,61.44 LED71.1 18.3,61.44 21.62,61.44 LED65.1 24.16,61.44 27.47,61.44 LED70.1 30.01,61.44 33.33,61.44 LED68.1 35.87,61.44 39.18,61.44 LED64.1 41.72,61.44 45.03,61.44 LED66.1 47.57,61.44 50.89,61.44 52.16,62.71 53.43,61.44 56.74,61.44 LED73.1 59.28,61.44 62.6,61.44 LED74.1 ; LED74.1 65.14,61.44 68.45,61.44 LED75.1 70.99,61.44 74.3,61.44 LED76.1 76.84,61.44 80.16,61.44 LED77.1 82.7,61.44 86.01,61.44 LED78.1 88.55,61.44 91.87,61.44 LED79.1 94.41,61.44 97.72,61.44 LED80.1 100.26,61.44 103.57,61.44 LED81.1 106.11,61.44 109.43,61.44 LED82.1 111.97,61.44 115.28,61.44 LED83.1 117.82,61.44 121.14,61.44 LED84.1 123.68,61.44 126.99,61.44 LED85.1 129.53,61.44 132.84,61.44 LED86.1 135.38,61.44 138.7,61.44 LED87.1 141.24,61.44 144.55,61.44 LED88.1 147.09,61.44 150.41,61.44 LED89.1 152.95,61.44 156.26,61.44 LED90.1 158.8,61.44 162.11,61.44 LED91.1 164.65,61.44 167.97,61.44 LED92.1 170.51,61.44 173.82,61.44 LED93.1 176.36,61.44 180.44,61.44 180.95,61.95 ; LED136.1 6.6,46.71 9.91,46.71 LED133.1 12.45,46.71 15.76,46.71 LED135.1 18.3,46.71 21.62,46.71 LED129.1 24.16,46.71 27.47,46.71 LED134.1 30.01,46.71 33.33,46.71 LED132.1 35.87,46.71 39.18,46.71 LED128.1 ; 28.83,25.17 LED230.1 ; 69.85,77.19 69.99,77.19 70.99,76.18 75.07,76.18 75.57,76.68 ; 69.85,77.19 69.72,77.32 ; 180.95,61.95 LED94.1 ; 180.95,61.95 181.39,61.95 181.96,61.38 181.96,61.31 ; 7,23.88 10.01,23.88 11.3,25.17 ; 41.45,38.33 41.45,33.76 40.44,32.74 ; 11.3,25.17 LED229.1 ; 75.57,76.68 75.57,77.32 ; 40.44,32.74 LED192.1 41.72,31.47 45.03,31.47 LED194.1 47.57,31.47 50.89,31.47 52.16,32.74 53.43,31.47 56.74,31.47 LED201.1 59.28,31.47 62.6,31.47 LED202.1 65.14,31.47 68.45,31.47 LED203.1 70.99,31.47 74.3,31.47 LED204.1 76.84,31.47 80.16,31.47 LED205.1 82.7,31.47 86.01,31.47 LED206.1 88.55,31.47 91.87,31.47 LED207.1 94.41,31.47 97.72,31.47 LED208.1 100.26,31.47 103.57,31.47 LED209.1 106.11,31.47 109.43,31.47 LED210.1 111.97,31.47 115.28,31.47 LED211.1 117.82,31.47 121.14,31.47 LED212.1 123.68,31.47 126.99,31.47 LED213.1 129.53,31.47 132.84,31.47 LED214.1 135.38,31.47 138.7,31.47 LED215.1 141.24,31.47 144.55,31.47 LED216.1 147.09,31.47 150.41,31.47 LED217.1 152.95,31.47 156.26,31.47 LED218.1 158.8,31.47 162.11,31.47 LED219.1 164.65,31.47 167.97,31.47 LED220.1 170.51,31.47 173.82,31.47 LED221.1 176.36,31.47 179.68,31.47 LED222.1 182.22,31.47 185.53,31.47 LED223.1 ; 40.44,32.74 39.73,32.74 38.46,31.47 35.87,31.47 LED196.1 33.33,31.47 30.01,31.47 LED198.1 27.47,31.47 24.16,31.47 LED193.1 21.62,31.47 18.3,31.47 LED199.1 15.76,31.47 12.45,31.47 LED197.1 9.95,31.52 6.55,31.52 LED200.1 ; 40.45,54.59 LED96.1 ; LED7.1 47.62,76.13 50.84,76.13 52.16,77.45
  Top Layer w0.508: 6.55,31.52 7.62,30.45 7.62,27.54 LED232.1 ; 17.03,25.06 LED231.1 ; 6.83,24.05 8.65,22.23 8.91,22.23 ; NOREF#4.3 12.05,18.16 NOREF#2.3 15.8,5.79 C1.1
GPIO16: length 7.8
  Top Layer w0.508: U2.2 10.16,7.87 10.8,7.24 10.8,3.07 NOREF#9.1
IN: length 56.8
  Top Layer w0.254: 5.71,82.35 3.32,79.96 3.32,26.54
ROW0: length 238.4
  Top Layer w0.254: 190.1,76.81 189.34,76.05 186.04,76.05 v1(185.27,75.29) ; 190.1,76.81 190.1,77.32 ; 190.1,76.81 191.12,75.8 191.12,26.27 LED255.2 ; v1(6.71,75.29) 5.63,75.29 LED40.4
  Bottom Layer w0.254: v1(185.27,75.29) v1(6.71,75.29)
ROW1: length 185.8
  Top Layer w0.254: v1(185.27,67.79) 186.29,68.81 188.83,68.81 LED63.2 ; v1(6.79,67.74) 5.45,67.74 LED72.4
  Bottom Layer w0.254: v1(185.27,67.79) 6.84,67.79 v1(6.79,67.74)
ROW2: length 185.9
  Top Layer w0.254: v1(185.27,60.43) 186.29,61.44 188.83,61.44 LED95.2 ; v1(6.79,60.5) 5.58,60.5 LED104.4
  Bottom Layer w0.254: v1(185.27,60.43) 6.86,60.43 v1(6.79,60.5)
ROW3: length 185.8
  Top Layer w0.254: LED127.2 188.83,54.08 186.29,54.08 v1(185.27,53.06) ; LED136.4 6.66,52.88 v1(6.79,53.01)
  Bottom Layer w0.254: v1(185.27,53.06) 6.84,53.06 v1(6.79,53.01)
ROW4: length 185.9
  Top Layer w0.254: v1(6.79,45.39) 6.66,45.26 LED168.4 ; LED159.2 188.58,46.46 186.29,46.46 v1(185.27,45.44)
  Bottom Layer w0.254: v1(6.79,45.39) 6.84,45.44 v1(185.27,45.44)
ROW5: length 186
  Top Layer w0.254: LED191.2 188.58,38.84 186.29,38.84 v1(185.27,37.82) ; v1(6.79,37.9) 6.53,37.64 LED200.4
  Bottom Layer w0.254: v1(6.79,37.9) 6.86,37.82 v1(185.27,37.82)
ROW6: length 185.8
  Top Layer w0.254: v1(185.27,30.46) 186.04,31.22 188.58,31.22 LED223.2 ; LED232.4 5.49,30.31 v1(6.76,30.31)
  Bottom Layer w0.254: v1(185.27,30.46) 6.9,30.46 v1(6.76,30.31)
$1N3198: length 6
  Top Layer w0.254: 8.63,79.79 LED1.4 ; 8.63,77.32 8.63,79.67
$1N3202: length 6
  Top Layer w0.254: 14.48,77.32 14.48,79.67 ; 14.48,79.79 LED2.4
$1N3208: length 6
  Top Layer w0.254: 20.33,77.32 20.33,79.67 ; 20.33,79.79 LED3.4
$1N3216: length 6
  Top Layer w0.254: 26.19,77.32 26.19,79.67 ; 26.19,79.79 LED4.4
$1N3234: length 6
  Top Layer w0.254: 37.9,77.32 37.9,79.67 ; 37.9,79.79 LED6.4
$1N3244: length 6
  Top Layer w0.254: 43.75,79.79 LED7.4 ; 43.75,77.32 43.75,79.67
$1N3254: length 6
  Top Layer w0.254: 32.04,77.32 32.04,79.67 ; 32.04,79.79 LED5.4
$1N3258: length 6
  Top Layer w0.254: 49.6,79.79 52.16,82.35 ; 49.6,77.32 49.6,79.67
$1N3430: length 6
  Top Layer w0.254: 61.31,77.32 61.31,79.67 ; 61.31,79.79 LED10.4
$1N3438: length 6
  Top Layer w0.254: 55.46,77.32 55.46,79.67 ; 55.46,79.79 LED9.4
$1N3594: length 6
  Top Layer w0.254: 73.02,79.79 LED12.4 ; 73.02,77.32 73.02,79.67
$1N3602: length 6
  Top Layer w0.254: 67.17,79.79 LED11.4 ; 67.17,77.32 67.17,79.67
$1N3758: length 6
  Top Layer w0.254: 84.73,77.32 84.73,79.67 ; 84.73,79.79 LED14.4
$1N3766: length 6
  Top Layer w0.254: 78.87,79.79 LED13.4 ; 78.87,77.32 78.87,79.67
$1N3922: length 6
  Top Layer w0.254: 96.44,79.79 LED16.4 ; 96.44,77.32 96.44,79.67
$1N3930: length 6
  Top Layer w0.254: 90.58,77.32 90.58,79.67 ; 90.58,79.79 LED15.4
$1N4086: length 6
  Top Layer w0.254: 108.14,79.79 LED18.4 ; 108.14,77.32 108.14,79.67
$1N4094: length 6
  Top Layer w0.254: 102.29,79.79 LED17.4 ; 102.29,77.32 102.29,79.67
$1N4250: length 6
  Top Layer w0.254: 119.85,79.79 LED20.4 ; 119.85,77.32 119.85,79.67
$1N4258: length 6
  Top Layer w0.254: 114,79.79 LED19.4 ; 114,77.32 114,79.67
$1N4414: length 6
  Top Layer w0.254: 131.56,79.79 LED22.4 ; 131.56,77.32 131.56,79.67
$1N4422: length 6
  Top Layer w0.254: 125.71,79.79 LED21.4 ; 125.71,77.32 125.71,79.67
$1N4578: length 6
  Top Layer w0.254: 143.27,77.32 143.27,79.67 ; 143.27,79.79 LED24.4
$1N4586: length 6
  Top Layer w0.254: 137.41,79.79 LED23.4 ; 137.41,77.32 137.41,79.67
$1N4742: length 6
  Top Layer w0.254: 154.98,77.32 154.98,79.67 ; 154.98,79.79 LED26.4
$1N4750: length 6
  Top Layer w0.254: 149.12,79.79 LED25.4 ; 149.12,77.32 149.12,79.67
$1N4906: length 6
  Top Layer w0.254: 166.68,79.79 LED28.4 ; 166.68,77.32 166.68,79.67
$1N4914: length 6
  Top Layer w0.254: 160.83,77.32 160.83,79.67 ; 160.83,79.79 LED27.4
$1N5070: length 6
  Top Layer w0.254: 178.39,77.32 178.39,79.67 ; 178.39,79.79 LED30.4
$1N5078: length 6
  Top Layer w0.254: 172.54,77.32 172.54,79.67 ; 172.54,79.79 LED29.4
$1N5242: length 6
  Top Layer w0.254: 184.25,77.32 184.25,79.67 ; 184.25,79.79 LED31.4
$1N7595: length 6
  Top Layer w0.254: 102.29,70.08 102.29,72.43 LED49.4
$1N7599: length 6
  Top Layer w0.254: LED47.2 96.44,72.43 LED48.4
$1N7611: length 6
  Top Layer w0.254: LED46.4 84.73,72.43 LED45.2
$1N7615: length 6
  Top Layer w0.254: LED46.2 90.58,72.43 LED47.4
$1N7625: length 6
  Top Layer w0.254: 78.87,70.08 78.87,72.43 LED45.4
$1N7631: length 6
  Top Layer w0.254: LED43.2 73.02,72.43 LED44.4
$1N7637: length 6
  Top Layer w0.254: LED43.4 67.17,72.43 67.17,70.08
$1N7643: length 6
  Top Layer w0.254: LED42.4 61.31,72.43 LED41.2
$1N7657: length 6
  Top Layer w0.254: LED41.4 55.46,72.43 55.46,70.08
$1N7665: length 6
  Top Layer w0.254: LED34.2 49.6,72.43 52.16,74.98
$1N7671: length 6
  Top Layer w0.254: LED34.4 43.75,72.43 LED32.2
$1N7677: length 6
  Top Layer w0.254: LED36.4 34.6,72.63 LED38.2
$1N7685: length 6
  Top Layer w0.254: LED36.2 40.45,72.63 LED32.4
$1N7695: length 6
  Top Layer w0.254: LED38.4 26.19,72.43 LED33.2
$1N7703: length 6
  Top Layer w0.254: LED33.4 22.89,72.63 LED39.2
$1N7711: length 6
  Top Layer w0.254: LED37.4 11.18,72.63 LED40.2
$1N7717: length 6
  Top Layer w0.254: LED37.2 14.48,72.43 LED39.4
$1N7729: length 6
  Top Layer w0.254: LED51.4 114,72.43 114,70.08
$1N7739: length 6
  Top Layer w0.254: LED49.2 108.14,72.43 LED50.4
$1N7747: length 6
  Top Layer w0.254: 131.56,70.08 131.56,72.43 LED54.4
$1N7755: length 6
  Top Layer w0.254: LED53.4 125.71,72.43 125.71,70.08
$1N7763: length 6
  Top Layer w0.254: LED52.4 119.85,72.43 LED51.2
$1N7769: length 6
  Top Layer w0.254: LED55.4 137.41,72.43 LED54.2
$1N7781: length 6
  Top Layer w0.254: LED57.4 149.12,72.43 LED56.2
$1N7787: length 6
  Top Layer w0.254: LED56.4 143.27,72.43 LED55.2
$1N7793: length 6
  Top Layer w0.254: LED59.2 166.68,72.43 LED60.4
$1N7801: length 6
  Top Layer w0.254: LED58.2 160.83,72.43 LED59.4
$1N7807: length 6
  Top Layer w0.254: LED58.4 154.98,72.43 LED57.2
$1N7815: length 6
  Top Layer w0.254: LED62.4 178.39,72.43 LED61.2
$1N7827: length 6
  Top Layer w0.254: LED60.2 172.54,72.43 LED61.4
$1N7841: length 6
  Top Layer w0.254: LED63.4 184.25,72.43 LED62.2
$1N10228: length 6
  Top Layer w0.254: 102.29,62.71 102.29,65.06 LED81.4
$1N10232: length 6
  Top Layer w0.254: LED80.4 96.44,65.06 LED79.2
$1N10244: length 6
  Top Layer w0.254: LED78.4 84.73,65.06 LED77.2
$1N10248: length 6
  Top Layer w0.254: LED78.2 90.58,65.06 LED79.4
$1N10258: length 6
  Top Layer w0.254: 78.87,62.71 78.87,65.06 LED77.4
$1N10264: length 6
  Top Layer w0.254: LED75.2 73.02,65.06 LED76.4
$1N10270: length 6
  Top Layer w0.254: LED75.4 67.17,65.06 67.17,62.71
$1N10276: length 6
  Top Layer w0.254: LED74.4 61.31,65.06 LED73.2
$1N10290: length 6
  Top Layer w0.254: LED73.4 55.46,65.06 55.46,62.71
$1N10298: length 6
  Top Layer w0.254: LED66.2 49.6,65.06 52.16,67.61
$1N10304: length 6
  Top Layer w0.254: LED66.4 43.75,65.06 LED64.2
$1N10310: length 6
  Top Layer w0.254: LED70.2 34.6,65.27 LED68.4
$1N10318: length 6
  Top Layer w0.254: LED68.2 40.45,65.27 LED64.4
$1N10328: length 6
  Top Layer w0.254: LED70.4 26.19,65.06 LED65.2
$1N10336: length 6
  Top Layer w0.254: LED71.2 22.89,65.27 LED65.4
$1N10344: length 6
  Top Layer w0.254: LED69.4 11.18,65.27 LED72.2
$1N10350: length 6
  Top Layer w0.254: LED69.2 14.48,65.06 LED71.4
$1N10362: length 6
  Top Layer w0.254: LED83.4 114,65.06 114,62.71
$1N10372: length 6
  Top Layer w0.254: LED82.4 108.14,65.06 LED81.2
$1N10380: length 6
  Top Layer w0.254: 131.56,62.71 131.56,65.06 LED86.4
$1N10388: length 6
  Top Layer w0.254: 125.71,62.71 125.71,65.06 LED85.4
$1N10396: length 6
  Top Layer w0.254: LED83.2 119.85,65.06 LED84.4
$1N10402: length 6
  Top Layer w0.254: LED87.4 137.41,65.06 LED86.2
$1N10414: length 6
  Top Layer w0.254: LED89.4 149.12,65.06 LED88.2
$1N10420: length 6
  Top Layer w0.254: LED88.4 143.27,65.06 LED87.2
$1N10426: length 6
  Top Layer w0.254: LED91.2 166.68,65.06 LED92.4
$1N10434: length 6
  Top Layer w0.254: LED91.4 160.83,65.06 LED90.2
$1N10440: length 6
  Top Layer w0.254: LED89.2 154.98,65.06 LED90.4
$1N10448: length 6
  Top Layer w0.254: LED94.4 178.39,65.06 LED93.2
$1N10460: length 6
  Top Layer w0.254: LED93.4 172.54,65.06 LED92.2
$1N10474: length 6
  Top Layer w0.254: LED94.2 184.25,65.06 LED95.4
$1N12861: length 6
  Top Layer w0.254: LED113.4 102.29,57.69 102.29,55.35
$1N12865: length 6
  Top Layer w0.254: LED112.4 96.44,57.69 LED111.2
$1N12877: length 6
  Top Layer w0.254: LED109.2 84.73,57.69 LED110.4
$1N12881: length 6
  Top Layer w0.254: LED111.4 90.58,57.69 LED110.2
$1N12891: length 6
  Top Layer w0.254: 78.87,55.35 78.87,57.69 LED109.4
$1N12897: length 6
  Top Layer w0.254: LED107.2 73.02,57.69 LED108.4
$1N12903: length 6
  Top Layer w0.254: 67.17,55.35 67.17,57.69 LED107.4
$1N12909: length 6
  Top Layer w0.254: LED106.4 61.31,57.69 LED105.2
$1N12923: length 6
  Top Layer w0.254: LED105.4 55.46,57.69 55.46,55.35
$1N12931: length 6
  Top Layer w0.254: LED98.2 49.6,57.69 52.16,60.25
$1N12937: length 6
  Top Layer w0.254: LED98.4 43.75,57.69 LED96.2
$1N12943: length 6
  Top Layer w0.254: LED100.4 34.6,57.9 LED102.2
$1N12951: length 6
  Top Layer w0.254: LED100.2 40.45,57.9 LED96.4
$1N12961: length 6
  Top Layer w0.254: LED97.2 26.19,57.69 LED102.4
$1N12969: length 6
  Top Layer w0.254: LED103.2 22.89,57.9 LED97.4
$1N12977: length 6
  Top Layer w0.254: LED104.2 11.18,57.9 LED101.4
$1N12983: length 6
  Top Layer w0.254: LED101.2 14.48,57.69 LED103.4
$1N12995: length 6
  Top Layer w0.254: 114,55.35 114,57.69 LED115.4
$1N13005: length 6
  Top Layer w0.254: LED114.4 108.14,57.69 LED113.2
$1N13013: length 6
  Top Layer w0.254: LED118.4 131.56,57.69 131.56,55.35
$1N13021: length 6
  Top Layer w0.254: 125.71,55.35 125.71,57.69 LED117.4
$1N13029: length 6
  Top Layer w0.254: LED116.4 119.85,57.69 LED115.2
$1N13035: length 6
  Top Layer w0.254: LED119.4 137.41,57.69 LED118.2
$1N13047: length 6
  Top Layer w0.254: LED120.2 149.12,57.69 LED121.4
$1N13053: length 6
  Top Layer w0.254: LED120.4 143.27,57.69 LED119.2
$1N13059: length 6
  Top Layer w0.254: LED123.2 166.68,57.69 LED124.4
$1N13067: length 6
  Top Layer w0.254: LED123.4 160.83,57.69 LED122.2
$1N13073: length 6
  Top Layer w0.254: LED122.4 154.98,57.69 LED121.2
$1N13081: length 6
  Top Layer w0.254: LED125.2 178.39,57.69 LED126.4
$1N13093: length 6
  Top Layer w0.254: LED125.4 172.54,57.69 LED124.2
$1N13107: length 6
  Top Layer w0.254: LED127.4 184.25,57.69 LED126.2
$2N4691: length 6
  Top Layer w0.254: 125.71,40.36 125.71,42.71 LED181.4
$2N4697: length 6
  Top Layer w0.254: LED183.4 137.41,42.71 LED182.2
$2N4705: length 6
  Top Layer w0.254: 131.56,40.36 131.56,42.71 LED182.4
$2N4715: length 6
  Top Layer w0.254: LED160.4 40.45,42.92 LED164.2
$2N4723: length 6
  Top Layer w0.254: LED166.2 34.6,42.92 LED164.4
$2N4735: length 6
  Top Layer w0.254: LED161.2 26.19,42.71 LED166.4
$2N4741: length 6
  Top Layer w0.254: LED178.4 108.14,42.71 LED177.2
$2N4745: length 6
  Top Layer w0.254: LED179.2 119.85,42.71 LED180.4
$2N4753: length 6
  Top Layer w0.254: LED179.4 114,42.71 114,40.36
$2N4765: length 6
  Top Layer w0.254: LED177.4 102.29,42.71 102.29,40.36
$2N4769: length 6
  Top Layer w0.254: LED171.2 73.02,42.71 LED172.4
$2N4773: length 6
  Top Layer w0.254: LED174.4 84.73,42.71 LED173.2
$2N4781: length 6
  Top Layer w0.254: LED175.2 96.44,42.71 LED176.4
$2N4787: length 6
  Top Layer w0.254: LED174.2 90.58,42.71 LED175.4
$2N4799: length 6
  Top Layer w0.254: LED173.4 78.87,42.71 78.87,40.36
$2N4811: length 6
  Top Layer w0.254: LED171.4 67.17,42.71 67.17,40.36
$2N4819: length 6
  Top Layer w0.254: LED170.4 61.31,42.71 LED169.2
$2N4827: length 6
  Top Layer w0.254: LED169.4 55.46,42.71 55.46,40.36
$2N4837: length 6
  Top Layer w0.254: 52.16,45.26 49.6,42.71 LED162.2
$2N4845: length 6
  Top Layer w0.254: LED162.4 43.75,42.71 LED160.2
$2N4849: length 6
  Top Layer w0.254: LED167.2 22.89,42.92 LED161.4
$2N4855: length 6
  Top Layer w0.254: LED167.4 14.48,42.71 LED165.2
$2N4863: length 6
  Top Layer w0.254: LED165.4 11.18,42.92 LED168.2
$2N4877: length 6
  Top Layer w0.254: LED190.2 184.25,42.71 LED191.4
$2N4883: length 6
  Top Layer w0.254: LED189.2 178.39,42.71 LED190.4
$2N4889: length 6
  Top Layer w0.254: LED188.2 172.54,42.71 LED189.4
$2N4893: length 6
  Top Layer w0.254: LED157.2 178.39,50.33 LED158.4
$2N4901: length 6
  Top Layer w0.254: LED159.4 184.25,50.33 LED158.2
$2N4911: length 6
  Top Layer w0.254: LED157.4 172.54,50.33 LED156.2
$2N4917: length 6
  Top Layer w0.254: LED155.2 166.68,50.33 LED156.4
